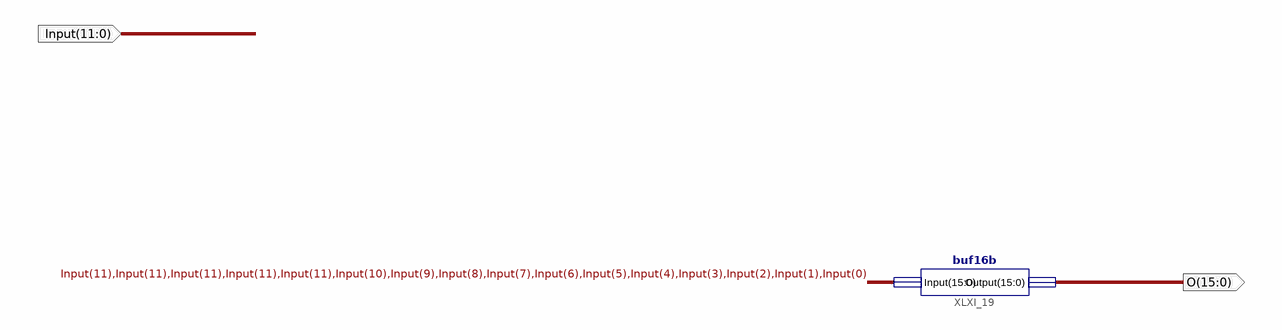
[diagram p0: schematic sheet 1]
// Xilinx ISE schematic signext12b16.sch (spartan3e) as structural Verilog: 1 symbols, 2 ports
module signext12b16 (
  input  [11:0] Input,
  output [15:0] O
);

  buf16b XLXI_19 (.Input({{5{Input[11]}}, Input[10:0]}), .Output(O));
endmodule
